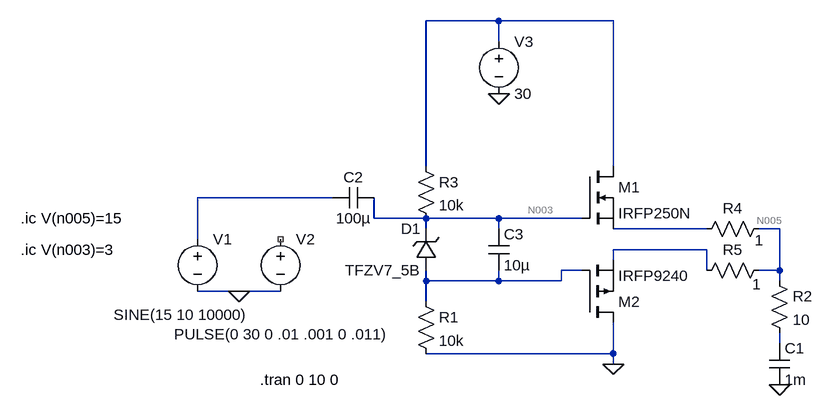
[diagram p0: schematic Draft1.asc]
Draft1.asc, the LTspice schematic file:
Version 4
SHEET 1 880 680
WIRE -64 -320 -176 -320
WIRE 112 -320 -64 -320
WIRE -64 -288 -64 -320
WIRE -176 -96 -176 -320
WIRE 112 -96 112 -320
WIRE -320 -48 -528 -48
WIRE -256 -16 -256 -48
WIRE -176 -16 -256 -16
WIRE -64 -16 -176 -16
WIRE 64 -16 -64 -16
WIRE -176 0 -176 -16
WIRE -64 0 -64 -16
WIRE 256 0 112 0
WIRE 368 0 336 0
WIRE -528 16 -528 -48
WIRE 256 32 112 32
WIRE 112 48 112 32
WIRE 64 64 32 64
WIRE 256 64 256 32
WIRE 368 64 368 0
WIRE 368 64 336 64
WIRE -176 80 -176 64
WIRE -64 80 -64 64
WIRE -64 80 -176 80
WIRE 32 80 32 64
WIRE 32 80 -64 80
WIRE 368 80 368 64
WIRE -464 96 -528 96
WIRE -400 96 -464 96
WIRE -176 112 -176 80
WIRE 368 176 368 160
WIRE 112 192 112 144
WIRE 112 192 -176 192
WIRE 112 208 112 192
FLAG 112 208 0
FLAG -464 96 0
FLAG -64 -208 0
FLAG 368 240 0
SYMBOL nmos 64 -96 R0
SYMATTR InstName M1
SYMATTR Value IRFP250N
SYMBOL pmos 64 144 M180
SYMATTR InstName M2
SYMATTR Value IRFP9240
SYMBOL res -192 96 R0
SYMATTR InstName R1
SYMATTR Value 10k
SYMBOL voltage -400 0 R0
WINDOW 3 -164 162 Left 2
WINDOW 123 0 0 Left 0
WINDOW 39 0 0 Left 0
SYMATTR InstName V2
SYMATTR Value PULSE(0 30 0 .01 .001 0 .011)
SYMBOL voltage -64 -304 R0
WINDOW 123 0 0 Left 0
WINDOW 39 0 0 Left 0
SYMATTR InstName V3
SYMATTR Value 30
SYMBOL res 352 64 R0
SYMATTR InstName R2
SYMATTR Value 10
SYMBOL cap 352 176 R0
SYMATTR InstName C1
SYMATTR Value 1m
SYMBOL zener -160 64 R180
WINDOW 0 24 64 Left 2
WINDOW 3 24 0 Left 2
SYMATTR InstName D1
SYMATTR Value TFZV7_5B
SYMBOL cap -256 -64 R90
WINDOW 0 0 32 VBottom 2
WINDOW 3 32 32 VTop 2
SYMATTR InstName C2
SYMATTR Value 100µ
SYMBOL res -192 -112 R0
SYMATTR InstName R3
SYMATTR Value 10k
SYMBOL cap -80 0 R0
SYMATTR InstName C3
SYMATTR Value 10µ
SYMBOL voltage -528 0 R0
WINDOW 3 -129 132 Left 2
WINDOW 123 0 0 Left 0
WINDOW 39 0 0 Left 0
SYMATTR InstName V1
SYMATTR Value SINE(15 10 10000)
SYMBOL res 352 -16 R90
WINDOW 0 0 56 VBottom 2
WINDOW 3 18 15 VTop 2
SYMATTR InstName R4
SYMATTR Value 1
SYMBOL res 352 48 R90
WINDOW 0 0 56 VBottom 2
WINDOW 3 22 19 VTop 2
SYMATTR InstName R5
SYMATTR Value 1
TEXT -432 232 Left 2 !.tran 0 10 0
TEXT -800 -16 Left 2 !.ic V(n005)=15
TEXT -800 32 Left 2 !.ic V(n003)=3

The netlist it stands for:
* Draft1.asc
M1 N001 N003 N004 N004 IRFP250N
M2 0 N007 N006 N006 IRFP9240
R1 N007 0 10k
V2 NC_01 0 PULSE(0 30 0 .01 .001 0 .011)
V3 N001 0 30
R2 N005 N008 10
C1 N008 0 1m
D1 N007 N003 TFZV7_5B
C2 N003 N002 100µ
R3 N001 N003 10k
C3 N003 N007 10µ
V1 N002 0 SINE(15 10 10000)
R4 N005 N004 1
R5 N005 N006 1
.model D D
.lib standard.dio
.model NMOS NMOS
.model PMOS PMOS
.lib standard.mos
.tran 0 10 0
.ic V(n005)=15
.ic V(n003)=3
.backanno
.end